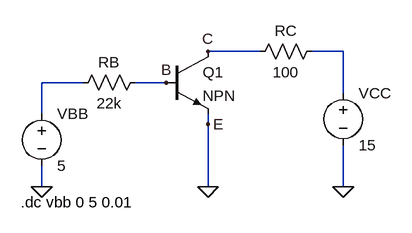
[diagram p0: schematic Draft1.asc]
Draft1.asc, the LTspice schematic file:
Version 4
SHEET 1 880 680
WIRE 336 80 256 80
WIRE 464 80 416 80
WIRE 64 128 0 128
WIRE 192 128 144 128
WIRE 464 144 464 80
WIRE 0 176 0 128
WIRE 256 192 256 176
WIRE 0 288 0 256
WIRE 256 288 256 192
WIRE 464 288 464 224
FLAG 0 288 0
FLAG 464 288 0
FLAG 256 288 0
FLAG 192 128 B
FLAG 256 80 C
FLAG 256 192 E
SYMBOL voltage 0 160 R0
SYMATTR InstName VBB
SYMATTR Value 5
SYMBOL voltage 464 128 R0
SYMATTR InstName VCC
SYMATTR Value 15
SYMBOL res 160 112 R90
WINDOW 0 0 56 VBottom 2
WINDOW 3 32 56 VTop 2
SYMATTR InstName RB
SYMATTR Value 22k
SYMBOL res 432 64 R90
WINDOW 0 0 56 VBottom 2
WINDOW 3 32 56 VTop 2
SYMATTR InstName RC
SYMATTR Value 100
SYMBOL npn 192 80 R0
SYMATTR InstName Q1
TEXT -32 312 Left 2 !.dc vbb 0 5 0.01

The netlist it stands for:
* Draft1.asc
VBB N002 0 5
VCC N001 0 15
RB B N002 22k
RC N001 C 100
Q1 C B 0 0 NPN
.model NPN NPN
.model PNP PNP
.lib standard.bjt
.dc vbb 0 5 0.01
.backanno
.end